# Altium project JBC1.PrjPcb
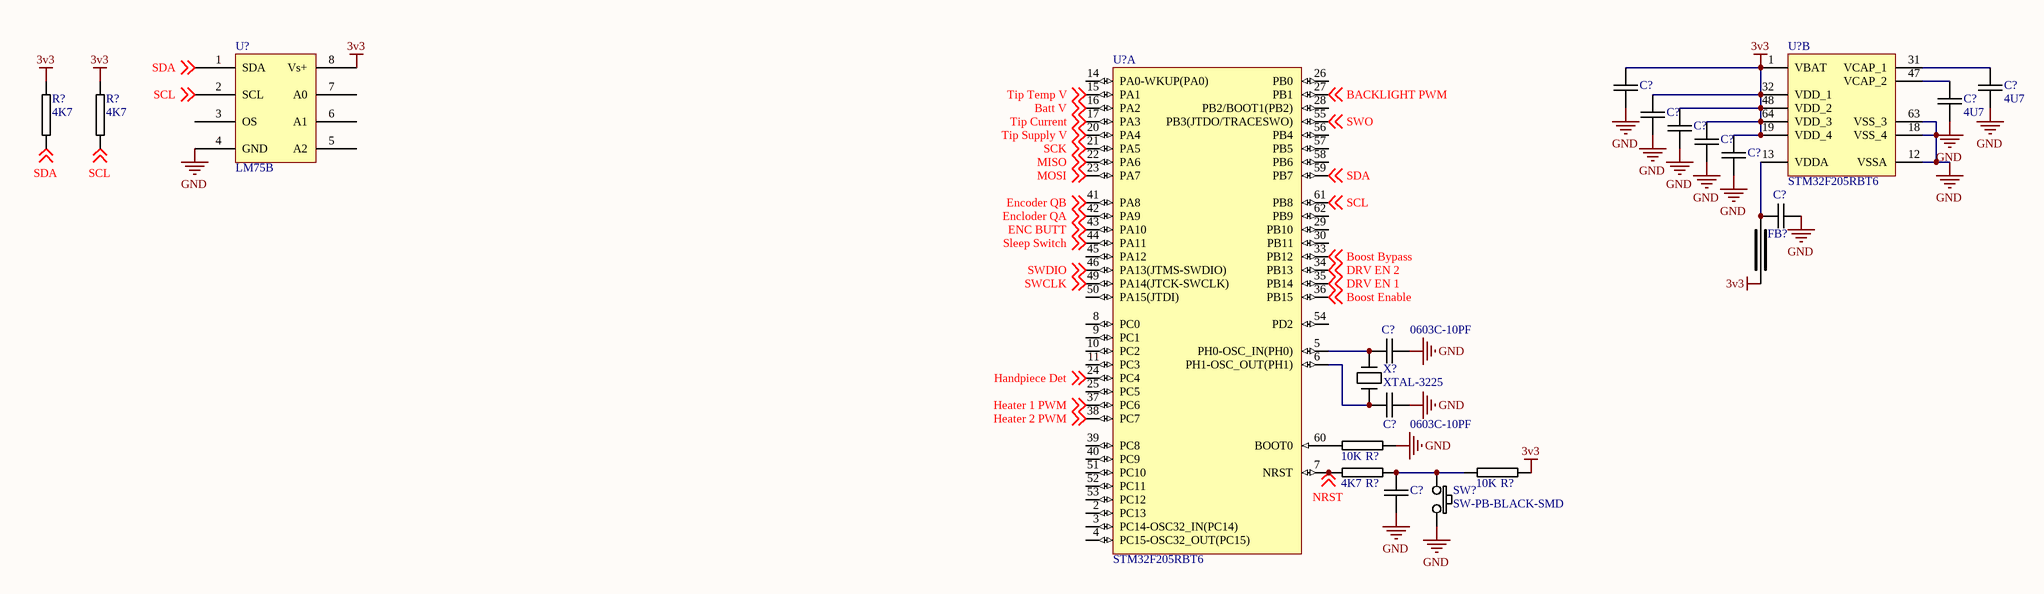
[diagram p0: Micro & LCD.SchDoc]
4 sheets, 64 parts. Net scope: global (net labels, ports and power ports of the same name join across sheets).
Sheets:
  Overview.SchDoc
  Micro & LCD.SchDoc
  Connectors.SchDoc
  Analog.SchDoc

## Sheet Overview.SchDoc
size A3

## Sheet Micro & LCD.SchDoc
size A3

### Parts
(Parts that share a designator on the sheet are numbered #1, #2 ... from top to bottom, then left to right.)
C?#1  0603C-100N-35V-X5R  [0603C-GENERIC]  (value not drawn)
C?#2  4U7  [1206C-GENERIC]
C?#3  4U7  [1206C-GENERIC]
C?#4  0603C-100N-35V-X5R  [0603C-GENERIC]  (value not drawn)
C?#5  0603C-100N-35V-X5R  [0603C-GENERIC]  (value not drawn)
C?#6  0603C-100N-35V-X5R  [0603C-GENERIC]  (value not drawn)
C?#7  0603C-100N-35V-X5R  [0603C-GENERIC]  (value not drawn)
C?#8  0603C-100N-35V-X5R  [0603C-GENERIC]  (value not drawn)
C?#9  0603C-10PF  [0603C-GENERIC]
C?#10  0603C-10PF  [0603C-GENERIC]
C?#11  0603C-100N-35V-X5R  [0603C-GENERIC]  (value not drawn)
FB?  0603FB-GENERIC  [0603FB-GENERIC]  (value not drawn)
R?#1  4K7  [0603R-4K7]
R?#2  4K7  [0603R-4K7]
R?#3  10K  [0603R-10K]
R?#4  4K7  [0603R-4K7]
R?#5  10K  [0603R-10K]
SW?  SW-PB-BLACK-SMD  [SW-PB-SMD]
U?#1  STM32F205RBT6  [STM-LQFP64_N]  (part B of 2)
U?#2  STM32F205RBT6  [STM-LQFP64_N]  (part A of 2)
U?#3  LM75B  [SO8]
X?  XTAL-3225  [XTAL-3225]

### Nets
3v3: C?#1.1 C?#4.1 C?#5.1 C?#6.1 C?#7.1 FB?.1 R?#1.1 R?#2.1 R?#5.2 U?#1.1(VBAT) U?#1.19(VDD_4) U?#1.32(VDD_1) U?#1.48(VDD_2) U?#1.64(VDD_3) U?#3.8(Vs+)
GND: C?#1.2 C?#2.2 C?#3.2 C?#4.2 C?#5.2 C?#6.2 C?#7.2 C?#8.2 C?#9.2 C?#10.2 C?#11.2 R?#3.2 SW?.2 U?#1.12(VSSA) U?#1.18(VSS_4) U?#1.63(VSS_3) U?#3.4(GND)
BACKLIGHT PWM: U?#2.27(PB1) ; off-sheet BACKLIGHT PWM
Batt V: U?#2.16(PA2) ; off-sheet Batt V
Boost Bypass: U?#2.33(PB12) ; off-sheet Boost Bypass
Boost Enable: U?#2.36(PB15) ; off-sheet Boost Enable
DRV EN 1: U?#2.35(PB14) ; off-sheet DRV EN 1
DRV EN 2: U?#2.34(PB13) ; off-sheet DRV EN 2
ENC BUTT: U?#2.43(PA10) ; off-sheet ENC BUTT
Encloder QA: U?#2.42(PA9) ; off-sheet Encloder QA
Encoder QB: U?#2.41(PA8) ; off-sheet Encoder QB
Handpiece Det: U?#2.24(PC4) ; off-sheet Handpiece Det
Heater 1 PWM: U?#2.37(PC6) ; off-sheet Heater 1 PWM
Heater 2 PWM: U?#2.38(PC7) ; off-sheet Heater 2 PWM
MISO: U?#2.22(PA6) ; off-sheet MISO
MOSI: U?#2.23(PA7) ; off-sheet MOSI
NRST: R?#4.1 U?#2.7(NRST) ; off-sheet NRST
SCK: U?#2.21(PA5) ; off-sheet SCK
SCL: R?#2.2 U?#2.61(PB8) U?#3.2(SCL) ; off-sheet SCL
SDA: R?#1.2 U?#2.59(PB7) U?#3.1(SDA) ; off-sheet SDA
Sleep Switch: U?#2.44(PA11) ; off-sheet Sleep Switch
SWCLK: U?#2.49(PA14(JTCK-SWCLK)) ; off-sheet SWCLK
SWDIO: U?#2.46(PA13(JTMS-SWDIO)) ; off-sheet SWDIO
SWO: U?#2.55(PB3(JTDO/TRACESWO)) ; off-sheet SWO
Tip Current: U?#2.17(PA3) ; off-sheet Tip Current
Tip Supply V: U?#2.20(PA4) ; off-sheet Tip Supply V
Tip Temp V: U?#2.15(PA1) ; off-sheet Tip Temp V
NetC?#2_1: C?#2.1 U?#1.31(VCAP_1)
NetC?#3_1: C?#3.1 U?#1.47(VCAP_2)
NetC?#8_1: C?#8.1 FB?.2 U?#1.13(VDDA)
NetC?#9_1: C?#9.1 U?#2.5(PH0-OSC_IN(PH0)) X?.1
NetC?#10_1: C?#10.1 U?#2.6(PH1-OSC_OUT(PH1)) X?.3
NetC?#11_1: C?#11.1 R?#4.2 R?#5.1 SW?.1
NetR?#3_1: R?#3.1 U?#2.60(BOOT0)

Not connected (* = marked no-connect by the designer): U?#2 2(PC13) 3(PC14-OSC32_IN(PC14)) 4(PC15-OSC32_OUT(PC15)) 8(PC0) 9(PC1) 10(PC2) 11(PC3) 14(PA0-WKUP(PA0)) 25(PC5) 26(PB0) 28(PB2/BOOT1(PB2)) 29(PB10) 30(PB11) 39(PC8) 40(PC9) 45(PA12) 50(PA15(JTDI)) 51(PC10) 52(PC11) 53(PC12) 54(PD2) 56(PB4) 57(PB5) 58(PB6) 62(PB9); U?#3 3(OS) 5(A2) 6(A1) 7(A0)

### Library data of the parts
C?#1 C?#4-C?#8 C?#11 = 0603C-100N-35V-X5R: CAPACITOR 0603 CERAMIC
C?#2 C?#3 = 1206C-4U7-50V: CAPACITOR 1206 CERAMIC
C?#9 C?#10 = 0603C-10PF: CAPACITOR 0603 CERAMIC
FB? = 0603FB-GENERIC: FERRITE BEAD SMD
R?#1 R?#2 R?#4 = 0603R-4K7: GENERIC RESISTOR 0603; Manufacturer: Stackpole Electronics Inc; Manufacturer Part Number: RMCF 1/16 4.7K 1% R; Reel: R23; Supplier 1: Digi-Key; Supplier Part Number 1: RMCF0603FT4K70TR-ND
R?#3 R?#5 = 0603R-10K: GENERIC RESISTOR 0603; Manufacturer: Stackpole Electronics Inc; Manufacturer Part Number: RMCF 1/16 10K 1% R; Tolerance: ±1%; Power (Watts): 0.1W, 1/10W; Temperature Coefficient: ±100ppm/°C; Resistance In Ohms: 10.0K; Reel: R21; Category: Resistors; Supplier Part Number: RMCF1/1610KFRDKR-ND; Lead Style: Surface Mount (SMD - SMT); RoHS: RoHS Compliant; Packaging: Digi-Reel®; Case: 0603 (1608 metric); Composition: Thick Film; Supplier: Digi-Key; Supplier 1: Digi-Key; Supplier Part Number 1: RMCF0603FT10K0DKR-ND
SW? = SW-PB-BLACK-SMD: PUSHBUTTON SWITCH 6MM SMD
U?#1 U?#2 = STM32F205RBT6: ARM Cortex-M3 32-bit MCU, 128 KB Flash, 64 KB Internal RAM, 51 I/Os, 64-pin LQFP, -40 to 85 degC, Tray; D/A Converter: 2x12-bit (2 Channel); FLASH Size (Prog) (kB): 128; I/Os (High Current): 51; Internal RAM Size (kB): 64; Operating Frequency(F) (Processor speed) (MHz): 120; Supply Voltage(Vcc) min (V): 1.8; DatasheetVersion: Rev. 9; PackageVersion: Rev. 4, 06/2013; PackageReference: LQFP64; PackageDescription: 64-Pin Low Profile Quad Flat Package, 10 x 10 mm Body, 0.5 mm Pitch; Supplier 1: Digi-Key; Supplier Part Number 1: 497-11153-ND; Supplier 2: Farnell; Supplier Part Number 2: 2060895; Supplier 3: Newark; Supplier Part Number 3: 47T9327; Core: ARM Cortex-M3; Packing: Tray; Mounting Technology: Surface Mount; PartNumber: STM32F205RBT6; ComponentLink1Description: Manufacturer URL; ComponentLink1URL: http://www.st.com/web/en/home.html; ComponentLink2Description: Datasheet; ComponentLink2URL: http://www.st.com/st-web-ui/static/active/en/resource/technical/document/datasheet/CD00237391.pdf; ComponentLink3Description: Package Specification; ComponentLink3URL: http://www.st.com/st-web-ui/static/active/en/resource/technical/document/datasheet/DM00037051.pdf
U?#3 = LM75B: Integrated I2C Temperature Sensor
X? = XTAL-3225: GENERIC 3225 CRYSTAL

## Sheet Connectors.SchDoc
size A3
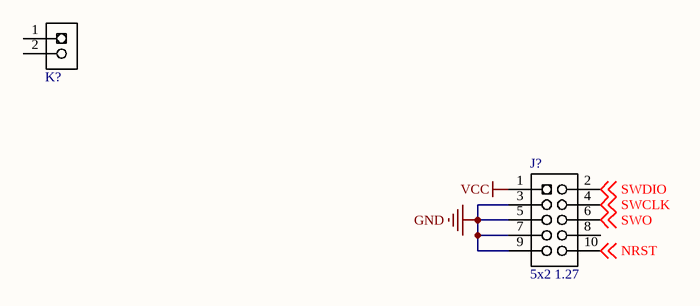
[diagram p1: Connectors.SchDoc]

### Parts
J?  5x2 1.27  [2x5 1.27mm]
K?  PLUGTERM5.08MM  [TERM2POS5.08]  (value not drawn)

### Nets
GND: J?.3(GND) J?.5(GND) J?.7(KEY) J?.9(GNDDetect)
VCC: J?.1(VCC)
NRST: J?.10(nRST) ; off-sheet NRST
SWCLK: J?.4(SWDCK/TCK) ; off-sheet SWCLK
SWDIO: J?.2(SWDIO/TMS) ; off-sheet SWDIO
SWO: J?.6(SWO/TDO) ; off-sheet SWO

Not connected (* = marked no-connect by the designer): J? 8(NC/TDI); K? 1 2

### Library data of the parts
J? = CORTEX 10 PIN: CORTEX 10 PIN 5x2 1.27mm
K? = PLUGTERM5.08MM: 2Pos Pluggable 5.08mm Terminal Block

## Sheet Analog.SchDoc
size A3
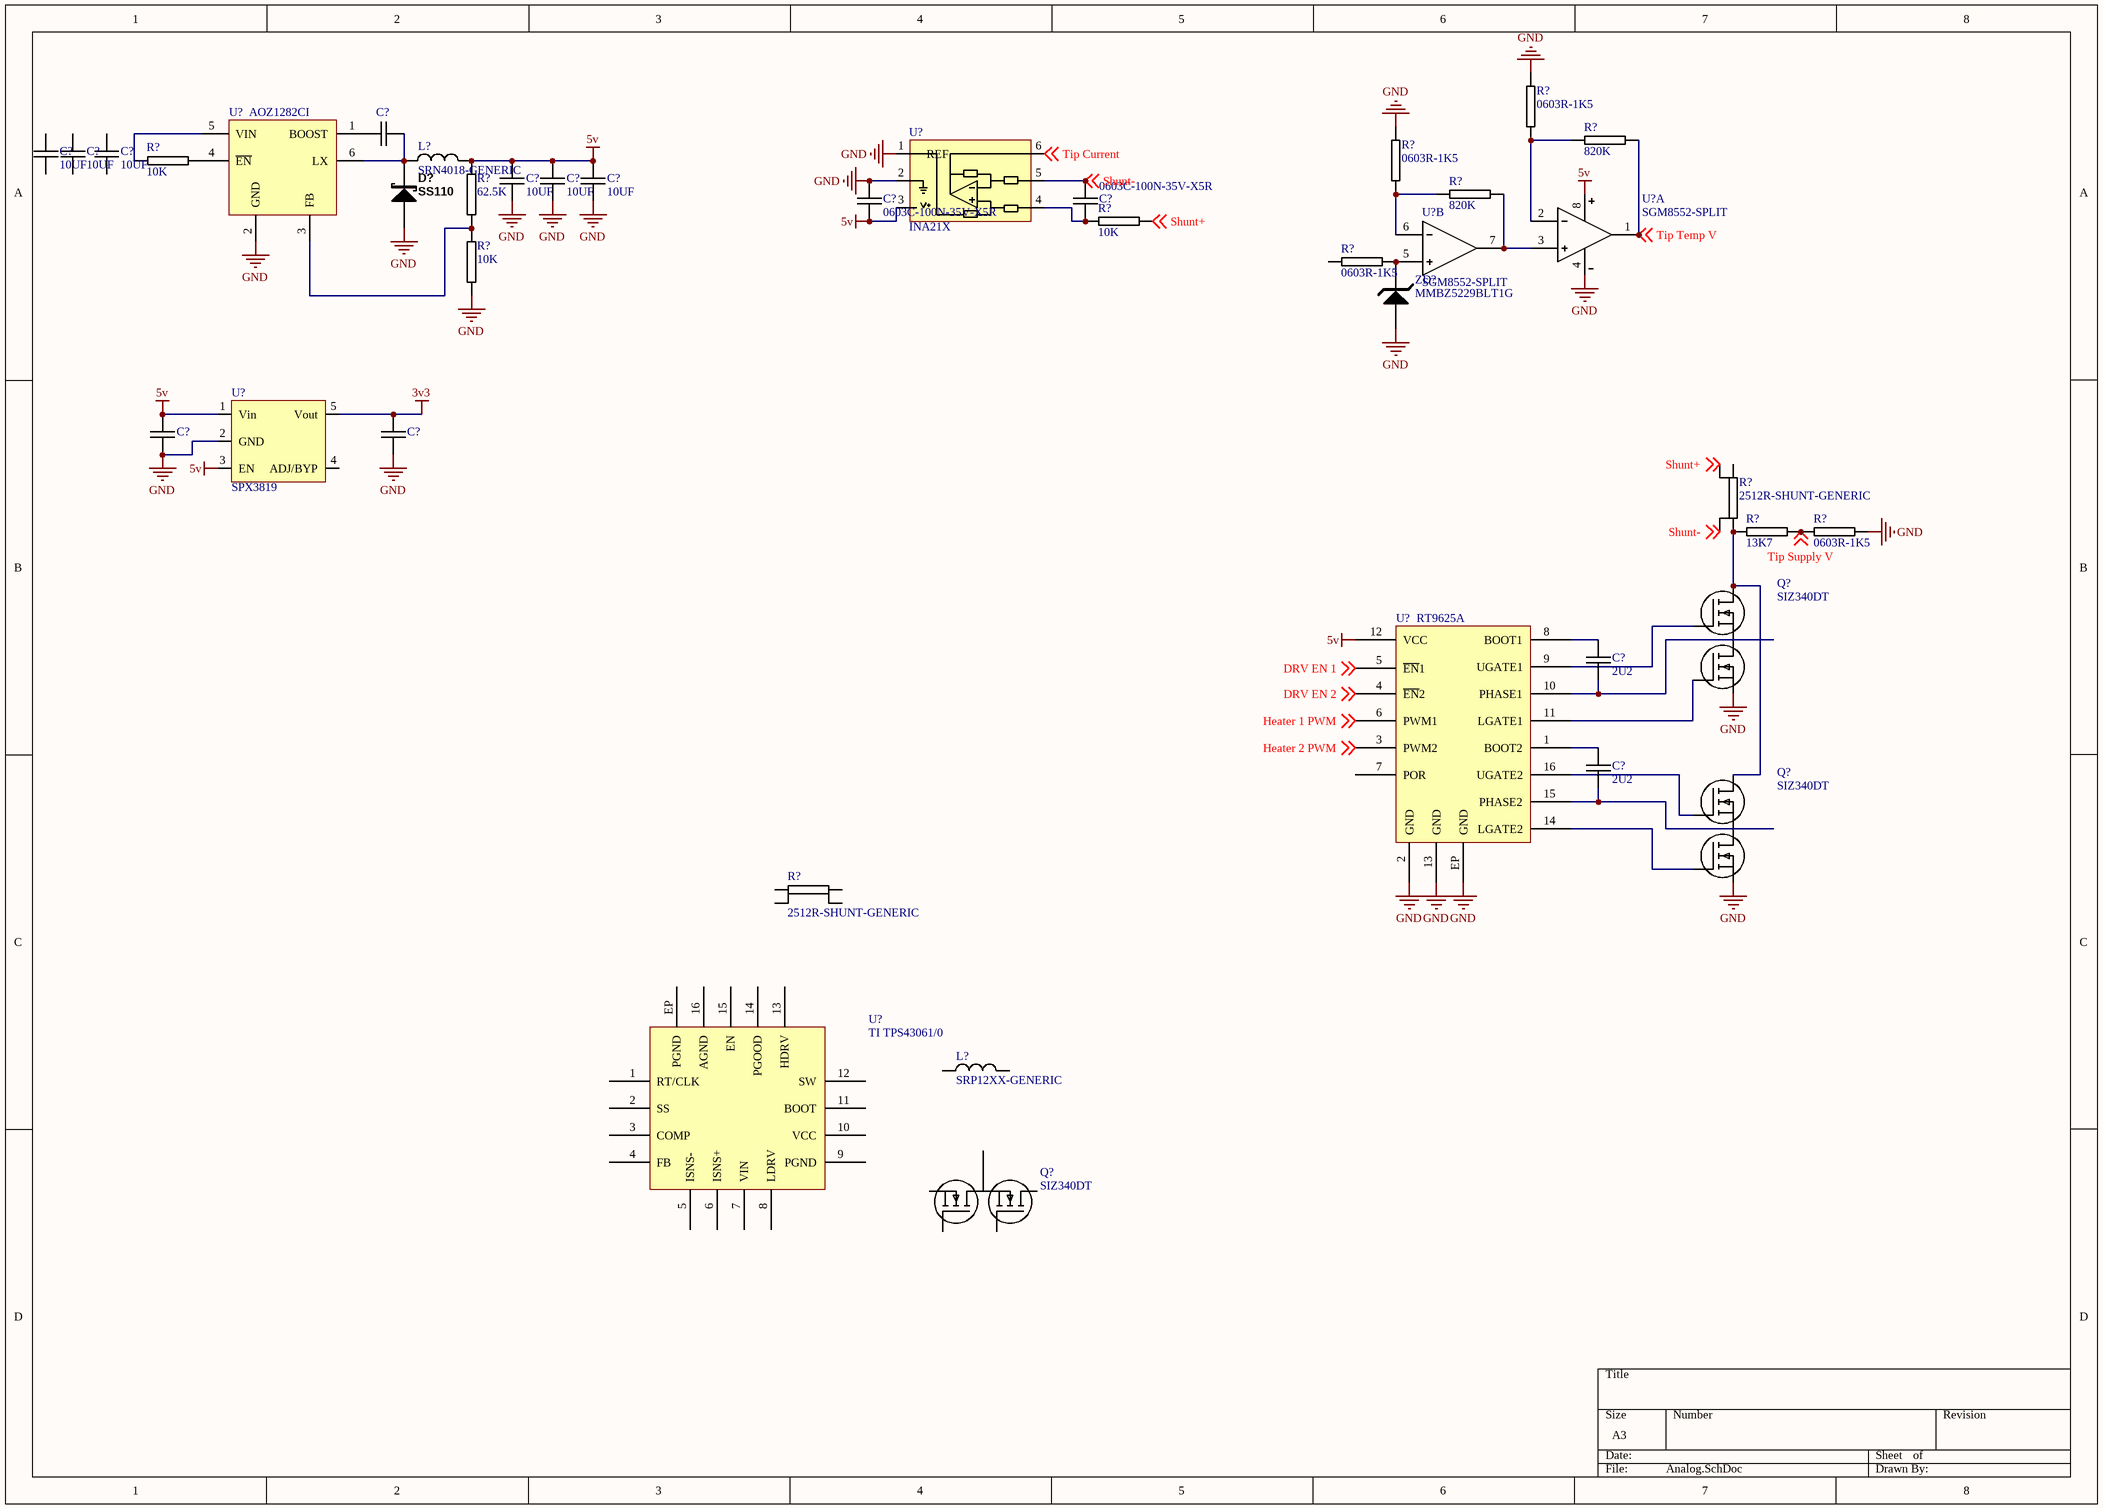
[diagram p2: Analog.SchDoc]

### Parts
(Parts that share a designator on the sheet are numbered #1, #2 ... from top to bottom, then left to right.)
C?#12  10UF  [1206C-GENERIC]
C?#13  10UF  [1206C-GENERIC]
C?#14  10UF  [1206C-GENERIC]
C?#15  0603C-100N-35V-X5R  [0603C-GENERIC]  (value not drawn)
C?#16  10UF  [1206C-GENERIC]
C?#17  10UF  [1206C-GENERIC]
C?#18  10UF  [1206C-GENERIC]
C?#19  0603C-100N-35V-X5R  [0603C-GENERIC]
C?#20  0603C-100N-35V-X5R  [0603C-GENERIC]
C?#21  0603C-100N-35V-X5R  [0603C-GENERIC]  (value not drawn)
C?#22  0603C-100N-35V-X5R  [0603C-GENERIC]  (value not drawn)
C?#23  2U2  [1206C-GENERIC]
C?#24  2U2  [1206C-GENERIC]
D?  SS110  [DIODE-SMA]
L?#1  SRN4018-GENERIC  [SRN4018]
L?#2  SRP12XX-GENERIC  [SRP1250]
Q?#1  SIZ340DT  [PowerPAIR  3 x 3]
Q?#2  SIZ340DT  [PowerPAIR  3 x 3]
Q?#3  SIZ340DT  [PowerPAIR  3 x 3]
R?#6  0603R-1K5  [0603R-1k5]
R?#7  0603R-1K5  [0603R-1k5]
R?#8  820K  [0603R-GENERIC]
R?#9  10K  [0603R-10K]
R?#10  62.5K  [0603R-68K]
R?#11  820K  [0603R-GENERIC]
R?#12  10K  [0603R-10K]
R?#13  0603R-1K5  [0603R-1k5]
R?#14  10K  [0603R-10K]
R?#15  2512R-SHUNT-GENERIC  [2512R-SHUNT]  (net tie, no BOM)
R?#16  13K7  [0603R-GENERIC]
R?#17  0603R-1K5  [0603R-1k5]
R?#18  2512R-SHUNT-GENERIC  [2512R-SHUNT]  (net tie, no BOM)
U?#4  AOZ1282CI  [SOT23-6]
U?#5  INA21X  [SC70-6]
U?#6  SGM8552-SPLIT  [MSOP8]  (part A of 2)
U?#7  SGM8552-SPLIT  [MSOP8]  (part B of 2)
U?#8  SPX3819  [SOT-23-5]
U?#9  RT9625A  [WQFN-16L 4x4 0.65mm]
U?#10  TI TPS43061/0  [S-PWQFN-N16]
ZD?  MMBZ5229BLT1G  [SOT23-DIODE]

### Nets
3v3: C?#22.2 U?#8.5(Vout)
5v: C?#16.1 C?#17.1 C?#18.1 C?#19.2 C?#21.2 L?#1.2 R?#10.1 U?#5.3(V+) U?#6.8(Vs+) U?#8.1(Vin) U?#8.3(EN) U?#9.12(VCC)
GND: C?#16.2 C?#17.2 C?#18.2 C?#19.1 C?#21.1 C?#22.1 D?.A Q?#1.S2 Q?#2.S2 R?#6.1 R?#7.1 R?#14.1 R?#17.2 U?#4.2(GND) U?#5.1(REF) U?#5.2(GND) U?#6.4(Vs-) U?#8.2(GND) U?#9.2(GND) U?#9.13(GND) U?#9.EP(GND) ZD?.A
DRV EN 1: U?#9.5(~{EN}1) ; off-sheet DRV EN 1
DRV EN 2: U?#9.4(~{EN}2) ; off-sheet DRV EN 2
Heater 1 PWM: U?#9.6(PWM1) ; off-sheet Heater 1 PWM
Heater 2 PWM: U?#9.3(PWM2) ; off-sheet Heater 2 PWM
Shunt+: R?#12.2 R?#15.4 ; off-sheet Shunt+
Shunt-: C?#20.1 R?#15.3 U?#5.5(IN-) ; off-sheet Shunt-
Tip Current: U?#5.6(OUT) ; off-sheet Tip Current
Tip Supply V: R?#16.2 R?#17.1 ; off-sheet Tip Supply V
Tip Temp V: R?#8.2 U?#6.1 ; off-sheet Tip Temp V
NetC?#15_1: C?#15.1 U?#4.1(BOOST)
NetC?#15_2: C?#15.2 D?.K L?#1.1 U?#4.6(LX)
NetC?#20_2: C?#20.2 R?#12.1 U?#5.4(IN+)
NetC?#23_1: C?#23.1 Q?#1.D2S1 U?#9.10(PHASE1)
NetC?#23_2: C?#23.2 U?#9.8(BOOT1)
NetC?#24_1: C?#24.1 Q?#2.D2S1 U?#9.15(PHASE2)
NetC?#24_2: C?#24.2 U?#9.1(BOOT2)
NetQ?#1_D1: Q?#1.D1 Q?#2.D1 R?#15.1 R?#16.1
NetQ?#1_G1: Q?#1.G1 U?#9.9(UGATE1)
NetQ?#1_G2: Q?#1.G2 U?#9.11(LGATE1)
NetQ?#2_G1: Q?#2.G1 U?#9.16(UGATE2)
NetQ?#2_G2: Q?#2.G2 U?#9.14(LGATE2)
NetR?#6_2: R?#6.2 R?#8.1 U?#6.2
NetR?#7_2: R?#7.2 R?#11.1 U?#7.6
NetR?#9_1: R?#9.1 U?#4.5(VIN)
NetR?#9_2: R?#9.2 U?#4.4(~{EN})
NetR?#10_2: R?#10.2 R?#14.2 U?#4.3(FB)
NetR?#11_2: R?#11.2 U?#6.3 U?#7.7
NetR?#13_2: R?#13.2 U?#7.5 ZD?.K

Not connected (* = marked no-connect by the designer): C?#12 1 2; C?#13 1 2; C?#14 1 2; L?#2 1 2; Q?#3 D1 D2S1 G1 G2 S2; R?#13 1; R?#15 2; R?#18 1 2 3 4; U?#8 4(ADJ/BYP); U?#9 7(POR); U?#10 1(RT/CLK) 2(SS) 3(COMP) 4(FB) 5(ISNS-) 6(ISNS+) 7(VIN) 8(LDRV) 9(PGND) 10(VCC) 11(BOOT) 12(SW) 13(HDRV) 14(PGOOD) 15(EN) 16(AGND) EP(PGND)

### Library data of the parts
C?#12-C?#14 C?#16-C?#18 = 1206C-10U-35V-X7R: GENERIC CAPACITOR NON POLARISED 1206; Manufacturer Part Number: GMK316F106ZL-T; Manufacturer: Taiyo Yuden; Reel: C90; Supplier 1: Digi-Key; Supplier Part Number 1: 587-1352-2-ND
C?#15 C?#19-C?#22 = 0603C-100N-35V-X5R: CAPACITOR 0603 CERAMIC
C?#23 C?#24 = 1206C-2U2-50V: CAPACITOR 1206 CERAMIC
D? = SS110: Schottky Diode SMA/DO-214AC
L?#1 = SRN4018-GENERIC: BOURNS SRN4018 Series Inductor
L?#2 = SRP12XX-GENERIC: BOURNS SRP12XX Series Inductor
Q?#1-Q?#3 = SIZ340DT: Dual N Channel MOSFET
R?#6 R?#7 R?#13 R?#17 = 0603R-1K5: GENERIC RESISTOR 0603; Manufacturer Part Number: RMCF 1/16 15K 1% R; Manufacturer: Stackpole Electronics Inc; Tolerance: ±1%; Resistance In Ohms: 15.0K; Power (Watts): 0.1W, 1/10W; Temperature Coefficient: ±100ppm/°C; Supplier 1: Digi-Key; Supplier Part Number 1: RMCF1/1615KFRTR-ND; Supplier: Digi-Key; Supplier Part Number: RMCF1/1615KFRTR-ND; Packaging: Tape & Reel (TR); Category: Resistors; Case: 0603 (1608 metric); Composition: Thick Film; Lead Style: Surface Mount (SMD - SMT); RoHS: RoHS Compliant
R?#8 R?#11 = 0603R-820K: GENERIC RESISTOR 0603; Manufacturer: Stackpole Electronics Inc; Manufacturer Part Number: RMC 1/16 820K 1% R; Power (Watts): 0.1W, 1/10W; Temperature Coefficient: ±100ppm/°C; Tolerance: ±1%; Supplier 1: Digi-Key; Supplier Part Number 1: RMC1/16820KFR-ND; Case: 0603 (1608 metric); RoHS: RoHS non-compliant; Supplier Part Number: RMC1/16820KFR-ND; Category: Resistors; Composition: Thick Film; Packaging: Tape & Reel (TR); Lead Style: Surface Mount (SMD - SMT); Resistance In Ohms: 820K; Supplier: Digi-Key
R?#9 R?#12 R?#14 = 0603R-10K: as R?#3 on sheet Micro & LCD; Category: Resistors; Supplier Part Number: RMCF1/1610KFRDKR-ND; Lead Style: Surface Mount (SMD - SMT); RoHS: RoHS Compliant; Packaging: Digi-Reel®; Case: 0603 (1608 metric); Composition: Thick Film; Supplier: Digi-Key; Supplier 1: Digi-Key; Supplier Part Number 1: RMCF0603FT10K0DKR-ND
R?#10 = 0603R-68K: GENERIC RESISTOR 0603
R?#15 R?#18 = 2512R-SHUNT-GENERIC: GENERIC SHUNT RESISTOR 2512; Reel: *
R?#16 = 0603R-13K7: GENERIC RESISTOR 0603; Supplier 1: Digi-Key; Supplier Part Number 1: RMCF0603FT13K7-ND
U?#4 = AOZ1282CI: 1.2A 36V Buck Regulator SOT-23-6
U?#5 = INA21X: Current Shunt Amplifier
U?#6 U?#7 = SGM8552-SPLIT: IC DUAL PRECISION OPAMP
U?#8 = SPX3819: SOT23-5 3v3
U?#9 = RT9625A: 24V Dual Half Bridge Driver
U?#10 = TI TPS43061/0: Synchronous Boost Converter
ZD? = MMBZ5229BLT1G: 4.3v Zener Diode

## Nets that join several sheets
3v3: Micro & LCD (15 pins), Analog (C?#22.2 U?#8.5)
GND: Micro & LCD (17 pins), Connectors (J?.3 J?.5 J?.7 J?.9), Analog (22 pins)
DRV EN 1: Micro & LCD (U?#2.35), Analog (U?#9.5)
DRV EN 2: Micro & LCD (U?#2.34), Analog (U?#9.4)
Heater 1 PWM: Micro & LCD (U?#2.37), Analog (U?#9.6)
Heater 2 PWM: Micro & LCD (U?#2.38), Analog (U?#9.3)
NRST: Micro & LCD (R?#4.1 U?#2.7), Connectors (J?.10)
SWCLK: Micro & LCD (U?#2.49), Connectors (J?.4)
SWDIO: Micro & LCD (U?#2.46), Connectors (J?.2)
SWO: Micro & LCD (U?#2.55), Connectors (J?.6)
Tip Current: Micro & LCD (U?#2.17), Analog (U?#5.6)
Tip Supply V: Micro & LCD (U?#2.20), Analog (R?#16.2 R?#17.1)
Tip Temp V: Micro & LCD (U?#2.15), Analog (R?#8.2 U?#6.1)